# Altium schematic sheet OpenPack_BATMOD_V1p0_USBC.SchDoc
size A4; SheetNumber: 3; SheetTotal: 10; Title_: USB C Connector
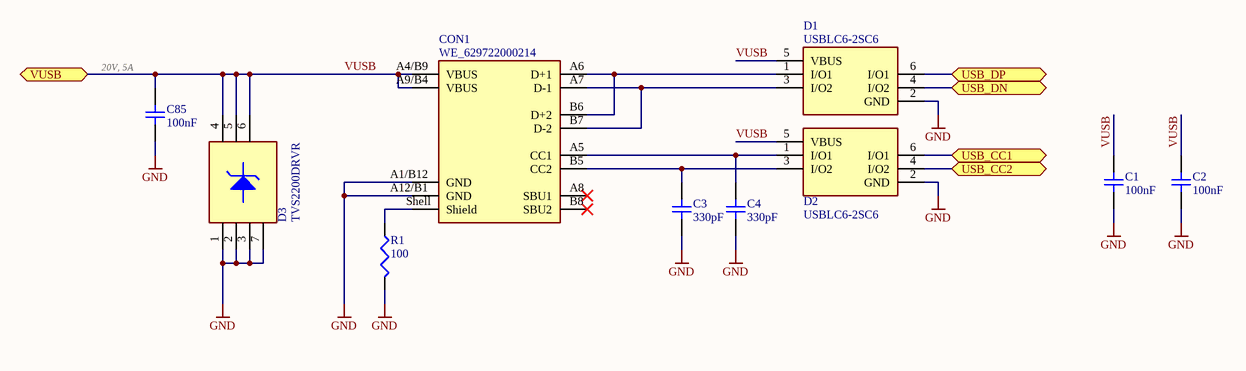
[diagram p0: OpenPack_BATMOD_V1p0_USBC.SchDoc]

## Parts
C1  100nF  [CAP_0603]
C2  100nF  [CAP_0603]
C3  330pF  [CAP_0603]
C4  330pF  [CAP_0603]
C85  100nF  [CAP_0603]
CON1  WE_629722000214  [WE_629722000214]
D1  USBLC6-2SC6  [SOT-23-6]
D2  USBLC6-2SC6  [SOT-23-6]
D3  TVS2200DRVR  [WSON-6]
R1  100  [RES-0603]

## Ports
USB_CC1 (bidir, see OpenPack_BATMOD_V1p0_MAIN, OpenPack_BATMOD_V1p0_MAN), USB_CC2 (bidir, see OpenPack_BATMOD_V1p0_MAIN, OpenPack_BATMOD_V1p0_MAN), USB_DN (bidir, see OpenPack_BATMOD_V1p0_MAIN, OpenPack_BATMOD_V1p0_MAN), USB_DP (bidir, see OpenPack_BATMOD_V1p0_MAIN, OpenPack_BATMOD_V1p0_MAN), VUSB (bidir, see OpenPack_BATMOD_V1p0_MAIN, OpenPack_BATMOD_V1p0_MAN)

## Nets
GND: C1.1 C2.1 C3.1 C4.1 C85.1 CON1.A1/B12(GND) CON1.A12/B1(GND) D1.2(GND) D2.2(GND) D3.1(GND) D3.2(GND) D3.3(GND) D3.7(GND) R1.2
USB_CC1: D2.6(I/O1) ; port USB_CC1
USB_CC2: D2.4(I/O2) ; port USB_CC2
USB_DN: D1.4(I/O2) ; port USB_DN
USB_DP: D1.6(I/O1) ; port USB_DP
VUSB: C1.2 C2.2 C85.2 CON1.A4/B9(VBUS) CON1.A9/B4(VBUS) D1.5(VBUS) D2.5(VBUS) D3.4(IN) D3.5(IN) D3.6(IN) ; port VUSB
NetC3_2: C3.2 CON1.B5(CC2) D2.3(I/O2)
NetC4_2: C4.2 CON1.A5(CC1) D2.1(I/O1)
NetCON1_A6: CON1.A6(D+1) CON1.B6(D+2) D1.1(I/O1)
NetCON1_A7: CON1.A7(D-1) CON1.B7(D-2) D1.3(I/O2)
NetCON1_Shell: CON1.Shell(Shield) R1.1

Not connected (* = marked no-connect by the designer): CON1 A8(SBU1)* B8(SBU2)*

## Notes on the sheet
- (near C85) 20V, 5A
- Board:
- Author:
- Title:
- Project:
- SVN:
- Version:
- Sheet:
- of
- Contact:
- Modified:
- Size:
- A4

## Library data of the parts
C1-C4 C85 = NP-CAPACITOR: MLCC capacitor; Type: CAP
CON1 = WE_629722000214: USB Connectors WR-COM Receptacle USB 2.0 Type C Horizontal SMT 16 pins- PCB Thickness 0.8mm; Part number: 710-629722000214; ComponentLink1Description: Datasheet; Supplier: Mouser; ComponentLink2Description: Order; ComponentLink2URL: https://hu.mouser.com/en/ProductDetail/Wurth-Elektronik/629722000214?qs=1Kr7Jg1SGW93XYhc8K3hvA%3D%3D; Type: CON?
D1 D2 = USBLC6-2SC6: ESD Protection Diodes / TVS Diodes ESD Protection Low Cap; Part number: 511-USBLC6-2SC6; Type: Diode; Supplier: Mouser; ComponentLink1Description: Datasheet; ComponentLink2Description: Order; ComponentLink2URL: https://hu.mouser.com/en/ProductDetail/STMicroelectronics/USBLC6-2SC6?qs=po45yt2pPpu%2FhNIlwQdTlg%3D%3D
D3 = TVS2200DRVR: ESD Protection Diodes / TVS Diodes 22V flat-clamp surge protection device 6; Part number: 595-TVS2200DRVR; Type: Diode; Supplier: Mouser; ComponentLink1Description: Datasheet; ComponentLink2Description: Order; ComponentLink2URL: https://hu.mouser.com/en/ProductDetail/Texas-Instruments/TVS2200DRVR?qs=W0yvOO0ixfHPbvei2cYdIw%3D%3D
R1 = RESISTOR: Metal Film Resistor; Type: RES